# Altium schematic sheet DB_Power-X01.SchDoc: DB POWER (part 1 of 3)
size Letter; Author: C. DEMOLDER; Engineer: C. DEMOLDER; Organization: GEORGIA TECH; Address1: NORTH AVE NW; Address2: ATLANTA, GA, 30332; DocumentNumber: P001; Revision: X01; SheetNumber: 3; SheetTotal: 4
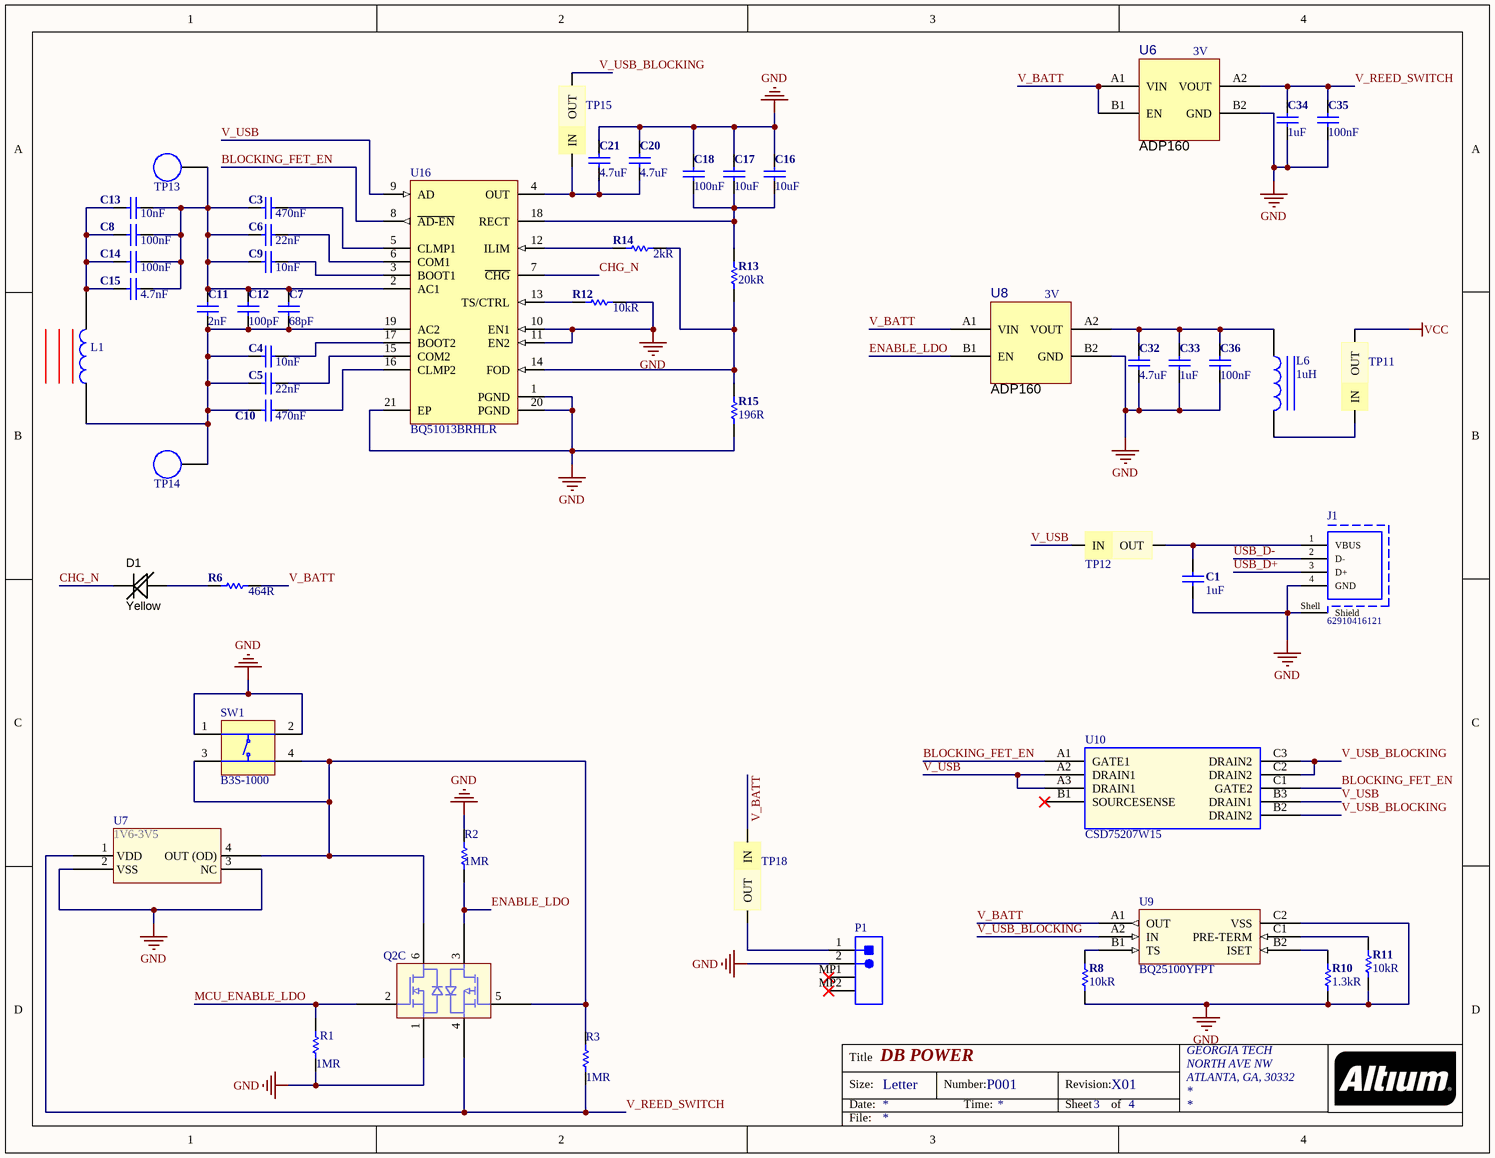
[diagram p0: DB_Power-X01.SchDoc]

## Parts
C1  1uF  [C0402]
C3  470nF  [C0402]
C4  10nF  [C0402]
C5  22nF  [C0402]
C6  22nF  [C0402]
C7  68pF  [C0402]
C8  100nF  [C0402]
C9  10nF  [C0402]
C10  470nF  [C0402]
C11  2nF  [C0402]
C12  100pF  [C0402]
C13  10nF  [C0402]
C14  100nF  [C0402]
C15  4.7nF  [C0402]
C16  10uF  [C0603]
C17  10uF  [C0603]
C18  100nF  [C0603]
C20  4.7uF  [C0402]
C21  4.7uF  [C0402]
C32  4.7uF  [C0402]
C33  1uF  [C0402]
C34  1uF  [C0402]
C35  100nF  [C0402]
C36  100nF  [C0402]
D1  Yellow  [LED_0402]
J1  62910416121  [62910416121]
L1  WIRELESS CHARGING COIL, RECEIVER  [760308101219]  (value not drawn)
L6  1uH  [L0402]
P1  B2B-PH-SM4-TB(LF)(SN)  [JST-B2B-PH-SM4-TB-2_V]  (value not drawn)
Q2  dual fet SSMini6  [SSMini6-F3-B]  (value not drawn)  (part C of 3)
R1  Resistance: 1MR  [RESC1005X37X25LL05T10]  (hidden comment: AC0402FR-071ML)
R2  Resistance: 1MR  [RESC1005X37X25LL05T10]  (hidden comment: AC0402FR-071ML)
R3  Resistance: 1MR  [RESC1005X37X25LL05T10]  (hidden comment: AC0402FR-071ML)
R6  464R  [R0402]
R8  10kR  [R0402]
R10  1.3kR  [R0402]
R11  10kR  [R0402]
R12  10kR  [R0402]
R13  20kR  [R0402]
R14  2kR  [R0402]
R15  196R  [R0402]
SW1  B3S-1000  [OMRON-B3S-1000-4_V]
TP11  JUMPER  [JUMPER]  (value not drawn)
TP12  JUMPER  [JUMPER]  (value not drawn)
TP13  S1751-46R  [S1751-46R]  (value not drawn)
TP14  S1751-46R  [S1751-46R]  (value not drawn)
TP15  JUMPER  [JUMPER]  (value not drawn)
TP18  JUMPER  [JUMPER]  (value not drawn)
U6  ADP160  Output Voltage: 3V  [ADP160]
U7  S-5712ANSL2-I4T1U  [SNT-4A]  (value not drawn)
U8  ADP160  Output Voltage: 3V  [ADP160]
U9  BQ25100YFPT  [YZP0006]
U10  CSD75207W15  [YZF0009]
U16  BQ51013BRHLR  [BQ51013BRHLR]

## Nets
GND: C1.2 C16.2 C17.2 C18.2 C20.1 C21.1 C32.2 C33.2 C34.2 C35.1 C36.1 J1.4(GND) J1.Shell(Shield) P1.2 Q2.1(S) R1.2 R2.2 R8.1 R10.2 R11.1 R12.2 R15.1 SW1.1 SW1.2 U6.B2(GND) U7.2(VSS) U7.3(NC) U8.B2(GND) U9.C2(VSS) U16.1(PGND) U16.10(EN1) U16.11(EN2) U16.20(PGND) U16.21(EP)
VCC: TP11.2(OUT)
BLOCKING_FET_EN: U10.A1(GATE1) U10.C1(GATE2) U16.8(~{AD-EN})
CHG_N: D1.K U16.7(~{CHG})
ENABLE_LDO: Q2.3(D) R2.1 U8.B1(EN)
MCU_ENABLE_LDO: Q2.2(G) R1.1
USB_D+: J1.3(D+)
USB_D-: J1.2(D-)
V_BATT: R6.2 TP18.1(IN) U6.A1(VIN) U6.B1(EN) U8.A1(VIN) U9.A1(OUT)
V_REED_SWITCH: C34.1 C35.2 Q2.4(S) R3.1 U6.A2(VOUT) U7.1(VDD)
V_USB: TP12.1(IN) U10.A2(DRAIN1) U10.A3(DRAIN1) U10.B3(DRAIN1) U16.9(AD)
V_USB_BLOCKING: TP15.2(OUT) U9.A2(IN) U10.B2(DRAIN2) U10.C2(DRAIN2) U10.C3(DRAIN2)
NetC1_1: C1.1 J1.1(VBUS) TP12.2(OUT)
NetC3_1: C3.1 C6.1 C7.1 C8.2 C9.1 C11.1 C12.1 C13.2 C14.2 C15.2 TP13.1 U16.2(AC1)
NetC3_2: C3.2 U16.5(CLMP1)
NetC4_1: C4.1 C5.1 C7.2 C10.1 C11.2 C12.2 L1.1 TP14.1 U16.19(AC2)
NetC4_2: C4.2 U16.17(BOOT2)
NetC5_2: C5.2 U16.15(COM2)
NetC6_2: C6.2 U16.6(COM1)
NetC8_1: C8.1 C13.1 C14.1 C15.1 L1.2
NetC9_2: C9.2 U16.3(BOOT1)
NetC10_2: C10.2 U16.16(CLMP2)
NetC16_1: C16.1 C17.1 C18.1 R13.1 U16.18(RECT)
NetC20_2: C20.2 C21.2 TP15.1(IN) U16.4(OUT)
NetC32_1: C32.1 C33.1 C36.2 L6.1 U8.A2(VOUT)
NetD1_A: D1.A R6.1
NetL6_2: L6.2 TP11.1(IN)
NetP1_1: P1.1 TP18.2(OUT)
NetQ2_5: Q2.5(G) Q2.6(D) R3.2 SW1.3 SW1.4 U7.4(OUT_(OD))
NetR8_2: R8.2 U9.B1(TS)
NetR10_1: R10.1 U9.B2(ISET)
NetR11_2: R11.2 U9.C1(PRE-TERM)
NetR12_1: R12.1 U16.13(TS/CTRL)
NetR13_2: R13.2 R14.2 R15.2 U16.14(FOD)
NetR14_1: R14.1 U16.12(ILIM)

Not connected (* = marked no-connect by the designer): P1 MP1* MP2*; U10 B1(SOURCESENSE)*

## Notes on the sheet
- Title
- Size:
- Date:
- Letter
- Number:
- Time:
- Revision:
- Sheet
- of
- File:
- (in symbol S-5712ANSL2-I4T1U) 1V6-3V5